# Altium schematic sheet MEMORY.SchDoc
size A; SheetNumber: 4; SheetTotal: 6
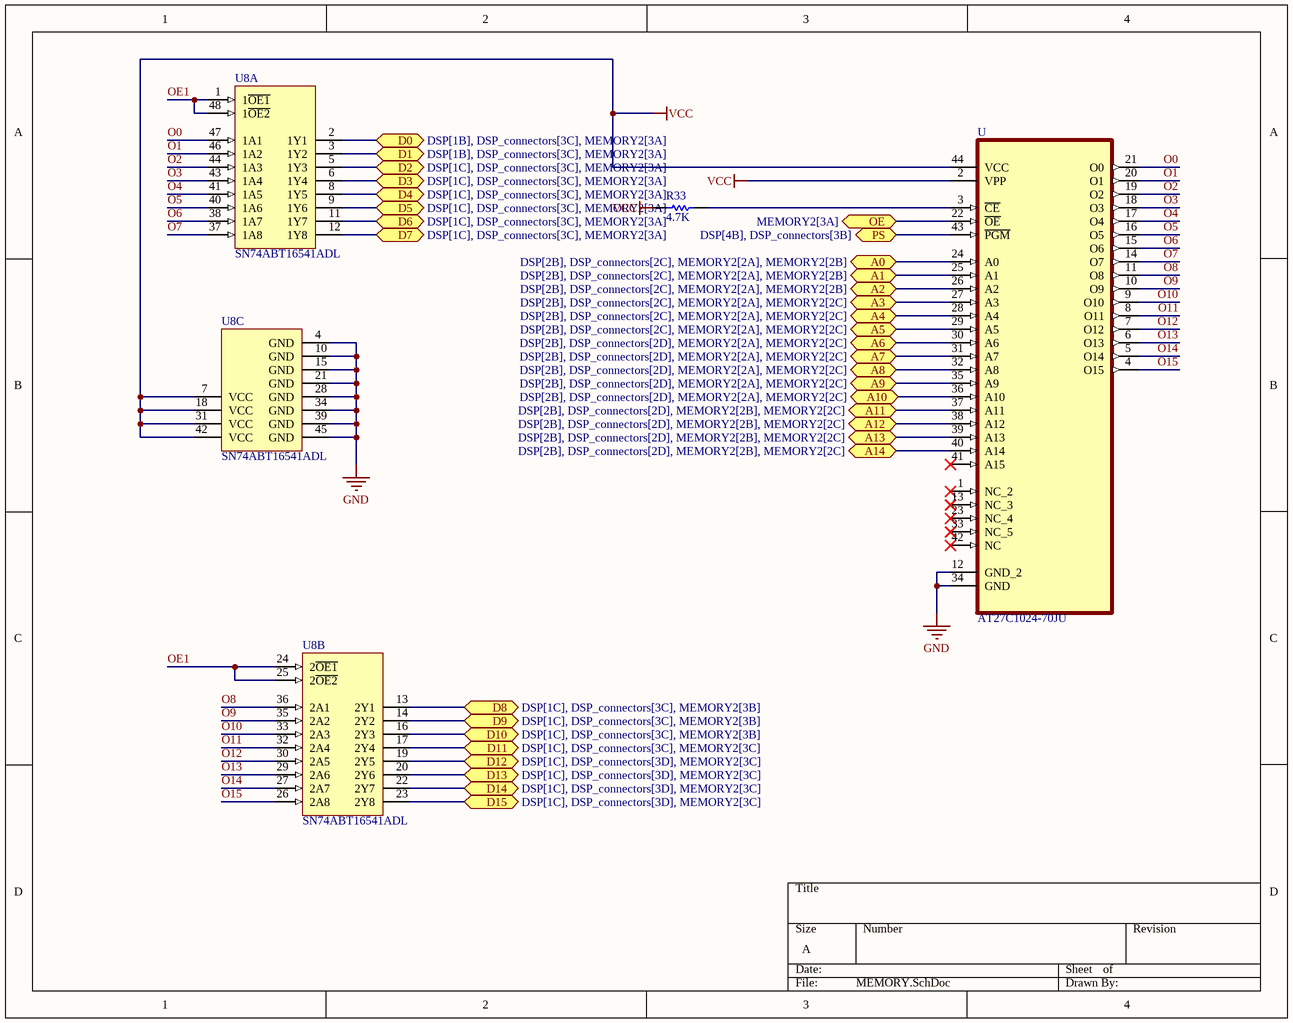
[diagram p0: MEMORY.SchDoc]

## Parts
R33  4.7K  [RESC2013X60X35ML10T20]
U  AT27C1024-70JU  [PLCC127P1752X1752X457-44N]
U8  SN74ABT16541ADL  [DL0048A_L]  (parts A,B,C of 3)

## Ports
A0 (bidir, see DSP[2B], DSP_connectors[2C], MEMORY2[2A], MEMORY2[2B]), A1 (bidir, see DSP[2B], DSP_connectors[2C], MEMORY2[2A], MEMORY2[2B]), A2 (bidir, see DSP[2B], DSP_connectors[2C], MEMORY2[2A], MEMORY2[2B]), A3 (bidir, see DSP[2B], DSP_connectors[2C], MEMORY2[2A], MEMORY2[2C]), A4 (bidir, see DSP[2B], DSP_connectors[2C], MEMORY2[2A], MEMORY2[2C]), A5 (bidir, see DSP[2B], DSP_connectors[2C], MEMORY2[2A], MEMORY2[2C]), A6 (bidir, see DSP[2B], DSP_connectors[2D], MEMORY2[2A], MEMORY2[2C]), A7 (bidir, see DSP[2B], DSP_connectors[2D], MEMORY2[2A], MEMORY2[2C]), A8 (bidir, see DSP[2B], DSP_connectors[2D], MEMORY2[2A], MEMORY2[2C]), A9 (bidir, see DSP[2B], DSP_connectors[2D], MEMORY2[2A], MEMORY2[2C]), A10 (bidir, see DSP[2B], DSP_connectors[2D], MEMORY2[2A], MEMORY2[2C]), A11 (bidir, see DSP[2B], DSP_connectors[2D], MEMORY2[2B], MEMORY2[2C]), A12 (bidir, see DSP[2B], DSP_connectors[2D], MEMORY2[2B], MEMORY2[2C]), A13 (bidir, see DSP[2B], DSP_connectors[2D], MEMORY2[2B], MEMORY2[2C]), A14 (bidir, see DSP[2B], DSP_connectors[2D], MEMORY2[2B], MEMORY2[2C]), D0 (bidir, see DSP[1B], DSP_connectors[3C], MEMORY2[3A]), D1 (bidir, see DSP[1B], DSP_connectors[3C], MEMORY2[3A]), D2 (bidir, see DSP[1C], DSP_connectors[3C], MEMORY2[3A]), D3 (bidir, see DSP[1C], DSP_connectors[3C], MEMORY2[3A]), D4 (bidir, see DSP[1C], DSP_connectors[3C], MEMORY2[3A]), D5 (bidir, see DSP[1C], DSP_connectors[3C], MEMORY2[3A]), D6 (bidir, see DSP[1C], DSP_connectors[3C], MEMORY2[3A]), D7 (bidir, see DSP[1C], DSP_connectors[3C], MEMORY2[3A]), D8 (bidir, see DSP[1C], DSP_connectors[3C], MEMORY2[3B]), D9 (bidir, see DSP[1C], DSP_connectors[3C], MEMORY2[3B]), D10 (bidir, see DSP[1C], DSP_connectors[3C], MEMORY2[3B]), D11 (bidir, see DSP[1C], DSP_connectors[3C], MEMORY2[3C]), D12 (bidir, see DSP[1C], DSP_connectors[3D], MEMORY2[3C]), D13 (bidir, see DSP[1C], DSP_connectors[3D], MEMORY2[3C]), D14 (bidir, see DSP[1C], DSP_connectors[3D], MEMORY2[3C]), D15 (bidir, see DSP[1C], DSP_connectors[3D], MEMORY2[3C]), OE (bidir, see MEMORY2[3A]), PS (bidir, see DSP[4B], DSP_connectors[3B])

## Nets
GND: U.12(GND_2) U.34(GND) U8.4(GND) U8.10(GND) U8.15(GND) U8.21(GND) U8.28(GND) U8.34(GND) U8.39(GND) U8.45(GND)
VCC: R33.1 U.2(VPP) U.44(VCC) U8.7(VCC) U8.18(VCC) U8.31(VCC) U8.42(VCC)
A0: U.24(A0) ; port A0
A1: U.25(A1) ; port A1
A2: U.26(A2) ; port A2
A3: U.27(A3) ; port A3
A4: U.28(A4) ; port A4
A5: U.29(A5) ; port A5
A6: U.30(A6) ; port A6
A7: U.31(A7) ; port A7
A8: U.32(A8) ; port A8
A9: U.35(A9) ; port A9
A10: U.36(A10) ; port A10
A11: U.37(A11) ; port A11
A12: U.38(A12) ; port A12
A13: U.39(A13) ; port A13
A14: U.40(A14) ; port A14
D0: U8.2(1Y1) ; port D0
D1: U8.3(1Y2) ; port D1
D2: U8.5(1Y3) ; port D2
D3: U8.6(1Y4) ; port D3
D4: U8.8(1Y5) ; port D4
D5: U8.9(1Y6) ; port D5
D6: U8.11(1Y7) ; port D6
D7: U8.12(1Y8) ; port D7
D8: U8.13(2Y1) ; port D8
D9: U8.14(2Y2) ; port D9
D10: U8.16(2Y3) ; port D10
D11: U8.17(2Y4) ; port D11
D12: U8.19(2Y5) ; port D12
D13: U8.20(2Y6) ; port D13
D14: U8.22(2Y7) ; port D14
D15: U8.23(2Y8) ; port D15
O0: U.21(O0) U8.47(1A1)
O1: U.20(O1) U8.46(1A2)
O2: U.19(O2) U8.44(1A3)
O3: U.18(O3) U8.43(1A4)
O4: U.17(O4) U8.41(1A5)
O5: U.16(O5) U8.40(1A6)
O6: U.15(O6) U8.38(1A7)
O7: U.14(O7) U8.37(1A8)
O8: U.11(O8) U8.36(2A1)
O9: U.10(O9) U8.35(2A2)
O10: U.9(O10) U8.33(2A3)
O11: U.8(O11) U8.32(2A4)
O12: U.7(O12) U8.30(2A5)
O13: U.6(O13) U8.29(2A6)
O14: U.5(O14) U8.27(2A7)
O15: U.4(O15) U8.26(2A8)
OE: U.22(~{OE}) ; port OE
OE1: U8.1(1~{OE1}) U8.24(2~{OE1}) U8.25(2~{OE2}) U8.48(1~{OE2})
PS: U.43(~{PGM}) ; port PS
NetR33_2: R33.2 U.3(~{CE})

Not connected (* = marked no-connect by the designer): U 1(NC_2)* 13(NC_3)* 23(NC_4)* 33(NC_5)* 41(A15)* 42(NC)*

## Library data of the parts
R33 = CMP-2100-03673-1: Chip Resistor, 0 Ohm, Jumper, +/- 5%, 0.125 W, -55 to 155 degC, 0805 (2012 Metric), RoHS, Tape and Reel; Manufacturer: Yageo; Power Rating: 125mW; Resistance: 0mOhm; Voltage Rating (DC): 150V; Temperature Coefficient: 200ppm/degreesC; Height: 0.5mm; Depth: 1.25mm; Case Code (Imperial): 0805; Lead Free: LeadFree; Military Standard: Not; Package Description: 2-Pin Surface Mounted Device, Body 2 x 1.25 mm; Case Code (Metric): 2012; Composition: ThickFilm; Voltage Rating: 150V; Manufacturer URL: http://www.yageo.com/; Packaging: TapeandReel; Package Reference: 0805; REACH SVHC: Unknown; Tolerance: 5%; Case/Package: 0805; Max Operating Temperature: 155degC; Number of Pins: 2; Min Operating Temperature: -55degC; RoHSCompliant: true; Length: 2mm; Datasheet URL: http://www.yageo.com/NewPortal/yageodocoutput?fileName=/pdf/R-Chip/PYu-RC_Group_51_RoHS_L_5.pdf; Termination: SMD/SMT; Radiation Hardening: No; Width: 1.25mm; Contact Plating: Tin; Datasheet Version: Rev. 5, 10/2016
U = AT27C1024-70JU: EPROM - OTP Memory IC 1Mb _64K x 16_ Parallel 70ns 44-PLCC _16.6x16.6_; MF: Microchip; MP: AT27C1024-70JU; SnapEDA_Link: https://www.snapeda.com/parts/AT27C1024-70JU/Microchip/view-part/1129317/?ref=snap; Price: None; Availability: Unavailable; Package: PLCC-44 Microchip; Value: *
U8 = CMP-0440-00612-3: 16-Bit Buffers/Drivers With 3-State Outputs, DL0048A, TUBE; Manufacturer: Texas Instruments; VCC(Min)(V): 4.5; VCC(Max)(V): 5.5; Input Type: TTL; F @ Nom Voltage(Max)(Mhz): 150; Rating: Catalog; ICC @ Nom Voltage(Max)(mA): 0.034; Bits(#): 16; Voltage(Nom)(V): 5; tpd @ Nom Voltage(Max)(ns): 4.2; PackageVersion: http://www.ti.com/lit/ml/mpds490/mpds490.pdf; PackageReference: DL0048A; Code_JEDEC: MO-118; Operating Temperature Range(C): -40 to 85; Generic Part Number: SN74ABT16541A; DatasheetVersion: SCBS118C; Output Type: TTL